# Altium schematic sheet SH5 - VOLTAGE SENSING.SchDoc: Power Distribution Board Rev2 - Voltage Sensing
size Letter; DrawnBy: Cindy Li; Organization: Altium Limited; Address1: L3, 12a Rodborough Rd; Address2: Frenchs Forest; Address3: NSW; Address4: Australia 2086
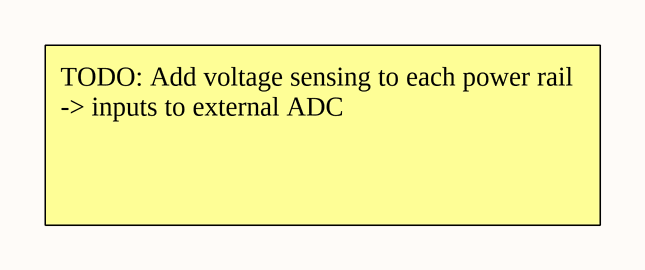
[diagram p0: SH5 - VOLTAGE SENSING.SchDoc]

## Notes on the sheet
- TODO: Add voltage sensing to each power rail -> inputs to external ADC
- Title
- Size:
- Date:
- Letter
- Drawn By:
- Sheet
- of
- File: